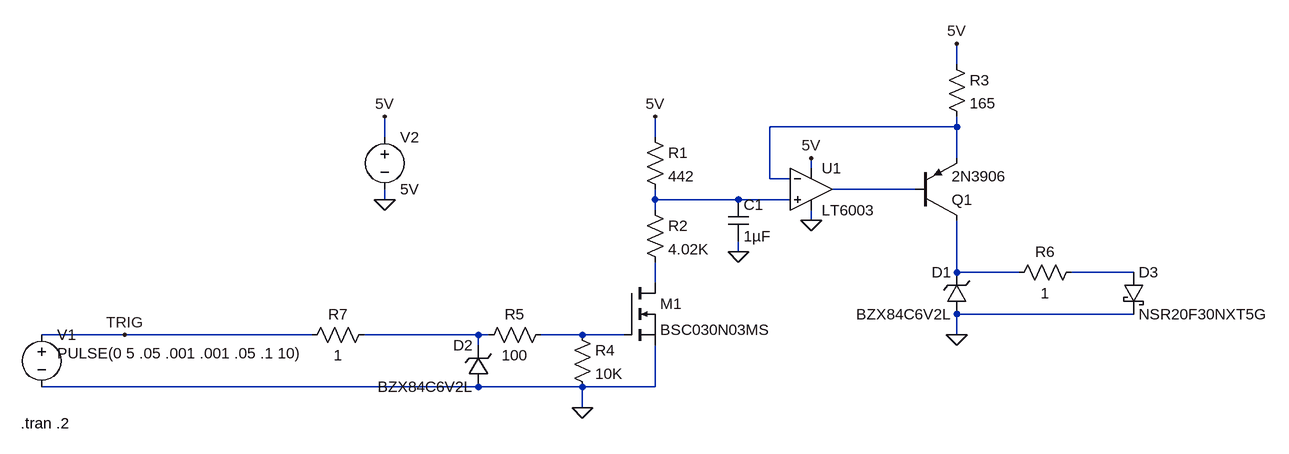
[diagram p0: schematic SupplySimulation.asc]
SupplySimulation.asc, the LTspice schematic file:
Version 4
SHEET 1 880 680
WIRE 400 -16 400 -48
WIRE 400 80 400 64
WIRE 400 80 112 80
WIRE -480 96 -480 64
WIRE -64 96 -64 64
WIRE 400 128 400 80
WIRE 176 144 176 128
WIRE 112 160 112 80
WIRE 144 160 112 160
WIRE 336 176 208 176
WIRE -480 192 -480 176
WIRE -64 192 -64 176
WIRE 64 192 -64 192
WIRE 144 192 64 192
WIRE -64 208 -64 192
WIRE 176 224 176 208
WIRE 64 272 64 256
WIRE 400 304 400 224
WIRE 496 304 400 304
WIRE 672 304 576 304
WIRE -64 320 -64 288
WIRE 672 368 400 368
WIRE -880 400 -1008 400
WIRE -592 400 -880 400
WIRE -336 400 -512 400
WIRE -320 400 -336 400
WIRE -176 400 -240 400
WIRE -112 400 -176 400
WIRE 400 400 400 368
WIRE -336 416 -336 400
WIRE -336 480 -1008 480
WIRE -176 480 -336 480
WIRE -64 480 -64 416
WIRE -64 480 -176 480
WIRE -176 512 -176 480
FLAG 176 224 0
FLAG -480 192 0
FLAG -176 512 0
FLAG -480 64 5V
FLAG -64 64 5V
FLAG 176 128 5V
FLAG 400 -48 5V
FLAG 400 400 0
FLAG -880 400 TRIG
FLAG 64 272 0
SYMBOL pnp 336 224 M180
SYMATTR InstName Q1
SYMATTR Value 2N3906
SYMBOL zener 416 368 R180
WINDOW 0 24 64 Left 2
WINDOW 3 24 0 Left 2
SYMATTR InstName D1
SYMATTR Value BZX84C6V2L
SYMBOL res -80 80 R0
SYMATTR InstName R1
SYMATTR Value 442
SYMBOL res -80 192 R0
SYMATTR InstName R2
SYMATTR Value 4.02K
SYMATTR SpiceLine tol=1
SYMBOL nmos -112 320 R0
SYMATTR InstName M1
SYMATTR Value BSC030N03MS
SYMBOL res 384 -32 R0
SYMATTR InstName R3
SYMATTR Value 165
SYMATTR SpiceLine tol=1
SYMBOL res -192 384 R0
SYMATTR InstName R4
SYMATTR Value 10K
SYMBOL res -224 384 R90
WINDOW 0 0 56 VBottom 2
WINDOW 3 32 56 VTop 2
SYMATTR InstName R5
SYMATTR Value 100
SYMBOL res 592 288 R90
WINDOW 0 0 56 VBottom 2
WINDOW 3 32 56 VTop 2
SYMATTR InstName R6
SYMATTR Value 1
SYMBOL zener -320 480 R180
WINDOW 0 24 64 Left 2
WINDOW 3 24 0 Left 2
SYMATTR InstName D2
SYMATTR Value BZX84C6V2L
SYMBOL voltage -1008 384 R0
WINDOW 3 24 44 Left 2
WINDOW 123 0 0 Left 2
WINDOW 39 0 0 Left 2
SYMATTR Value PULSE(0 5 .05 .001 .001 .05 .1 10)
SYMATTR InstName V1
SYMBOL voltage -480 80 R0
WINDOW 123 0 0 Left 2
WINDOW 39 0 0 Left 2
SYMATTR InstName V2
SYMATTR Value 5V
SYMBOL schottky 656 304 R0
SYMATTR InstName D3
SYMATTR Value NSR20F30NXT5G
SYMATTR Description Diode
SYMATTR Type diode
SYMBOL res -496 384 R90
WINDOW 0 0 56 VBottom 2
WINDOW 3 32 56 VTop 2
SYMATTR InstName R7
SYMATTR Value 1
SYMBOL Opamps\\LT6003 176 176 R0
SYMATTR InstName U1
SYMBOL cap 48 192 R0
SYMATTR InstName C1
SYMATTR Value 1µF
TEXT -1040 536 Left 2 !.tran .2

The netlist it stands for:
* SupplySimulation.asc
Q1 N004 N002 N001 0 2N3906
D1 0 N004 BZX84C6V2L
R1 5V N003 442
R2 N003 N006 4.02K tol=1
M1 N006 N008 0 0 BSC030N03MS
R3 5V N001 165 tol=1
R4 N008 0 10K
R5 N008 N007 100
R6 N005 N004 1
D2 0 N007 BZX84C6V2L
V1 TRIG 0 PULSE(0 5 .05 .001 .001 .05 .1 10)
V2 5V 0 5V
D3 N005 0 NSR20F30NXT5G
R7 N007 TRIG 1
* U1: LT6003 (symbol Opamps\LT6003 not available, pins judged from their places): In+=N003 In-=N001 V+=5V V-=0 OUT=N002
C1 N003 0 1µF
.model D D
.lib standard.dio
.model NPN NPN
.model PNP PNP
.lib standard.bjt
.model NMOS NMOS
.model PMOS PMOS
.lib standard.mos
.tran .2
.backanno
.end